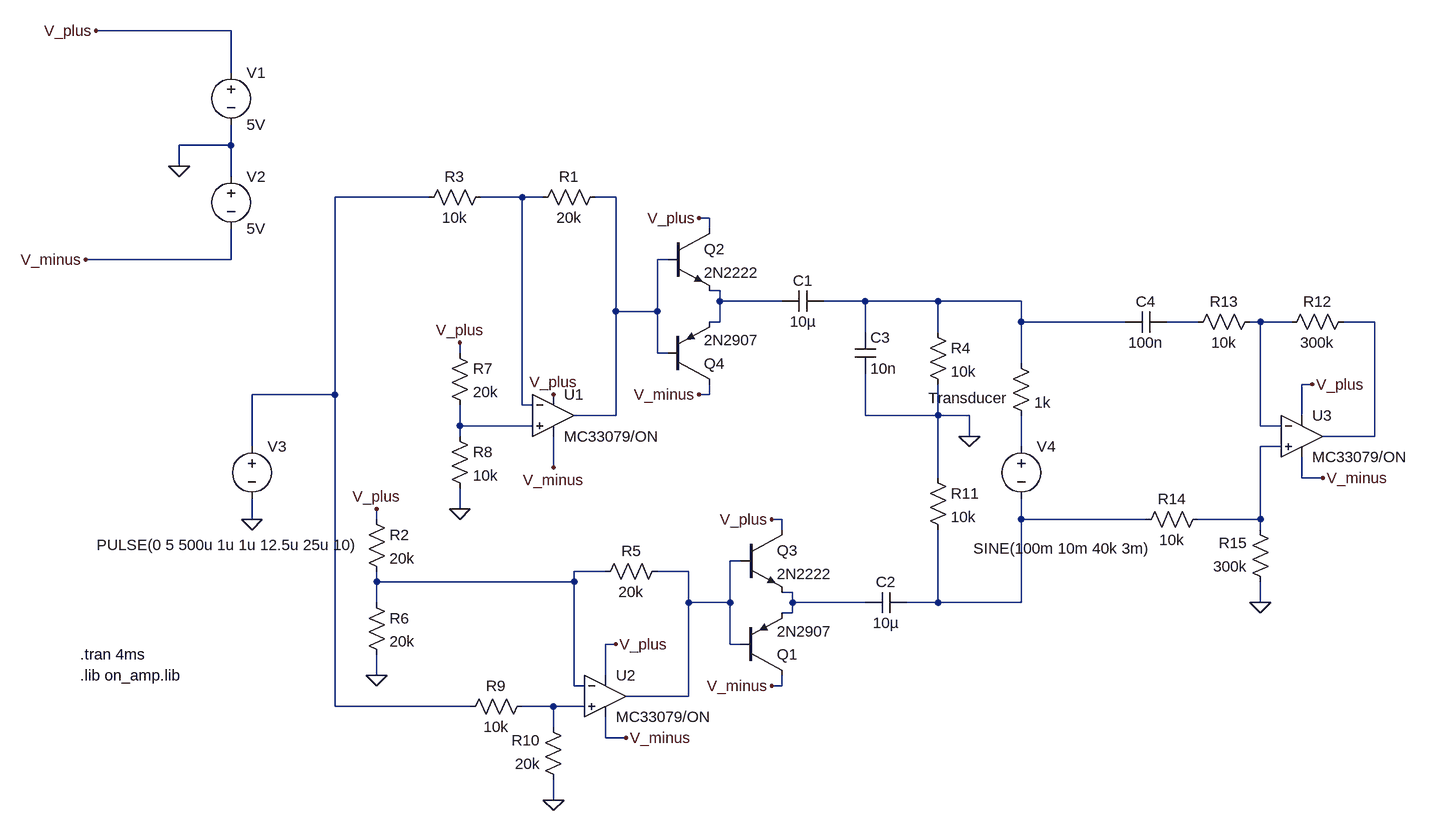
[diagram p0: schematic opamp_send_nosaturation_v02.asc]
opamp_send_nosaturation_v02.asc, the LTspice schematic file:
Version 4
SHEET 1 920 840
WIRE -1024 -448 -1232 -448
WIRE -1024 -384 -1024 -448
WIRE -1024 -272 -1024 -304
WIRE -1024 -272 -1104 -272
WIRE -1104 -240 -1104 -272
WIRE -1024 -224 -1024 -272
WIRE -720 -192 -864 -192
WIRE -576 -192 -640 -192
WIRE -544 -192 -576 -192
WIRE -432 -192 -464 -192
WIRE -288 -160 -304 -160
WIRE -288 -144 -288 -160
WIRE -1024 -96 -1024 -144
WIRE -1024 -96 -1248 -96
WIRE -352 -96 -368 -96
WIRE -272 -48 -288 -48
WIRE -272 -32 -272 -48
WIRE -176 -32 -272 -32
WIRE -48 -32 -112 -32
WIRE 64 -32 -48 -32
WIRE 192 -32 64 -32
WIRE -432 -16 -432 -192
WIRE -368 -16 -368 -96
WIRE -368 -16 -432 -16
WIRE -272 0 -272 -32
WIRE -272 0 -288 0
WIRE 192 0 192 -32
WIRE 352 0 192 0
WIRE 464 0 416 0
WIRE 560 0 544 0
WIRE 608 0 560 0
WIRE 736 0 688 0
WIRE -48 16 -48 -32
WIRE 64 16 64 -32
WIRE -672 48 -672 32
WIRE -368 48 -368 -16
WIRE -352 48 -368 48
WIRE 192 64 192 0
WIRE 640 96 624 96
WIRE -864 112 -864 -192
WIRE -864 112 -992 112
WIRE -288 112 -288 96
WIRE -288 112 -304 112
WIRE -576 128 -576 -192
WIRE -560 128 -576 128
WIRE -432 144 -432 -16
WIRE -432 144 -496 144
WIRE -48 144 -48 80
WIRE 64 144 64 96
WIRE 64 144 -48 144
WIRE 112 144 64 144
WIRE 624 144 624 96
WIRE -672 160 -672 128
WIRE -560 160 -672 160
WIRE 560 160 560 0
WIRE 592 160 560 160
WIRE -672 176 -672 160
WIRE 112 176 112 144
WIRE 736 176 736 0
WIRE 736 176 656 176
WIRE -992 192 -992 112
WIRE 192 192 192 144
WIRE 592 192 560 192
WIRE -528 224 -528 176
WIRE 64 240 64 144
WIRE 624 240 624 208
WIRE 656 240 624 240
WIRE -672 288 -672 256
WIRE -992 304 -992 272
WIRE -800 304 -800 288
WIRE -176 304 -192 304
WIRE 192 304 192 272
WIRE 384 304 192 304
WIRE 560 304 560 192
WIRE 560 304 464 304
WIRE -176 320 -176 304
WIRE 560 320 560 304
WIRE -240 368 -256 368
WIRE -448 384 -496 384
WIRE -320 384 -368 384
WIRE -800 400 -800 384
WIRE -496 400 -496 384
WIRE -496 400 -800 400
WIRE -160 416 -176 416
WIRE -800 432 -800 400
WIRE -320 432 -320 384
WIRE -256 432 -256 368
WIRE -256 432 -320 432
WIRE -160 432 -160 416
WIRE -48 432 -160 432
WIRE 64 432 64 320
WIRE 64 432 16 432
WIRE 192 432 192 304
WIRE 192 432 64 432
WIRE 560 432 560 400
WIRE -160 448 -160 432
WIRE -160 448 -176 448
WIRE -432 496 -448 496
WIRE -256 496 -256 432
WIRE -240 496 -256 496
WIRE -800 544 -800 512
WIRE -448 544 -448 496
WIRE -496 560 -496 400
WIRE -480 560 -496 560
WIRE -176 560 -176 544
WIRE -176 560 -192 560
WIRE -320 576 -320 432
WIRE -320 576 -416 576
WIRE -864 592 -864 112
WIRE -656 592 -864 592
WIRE -528 592 -576 592
WIRE -480 592 -528 592
WIRE -528 624 -528 592
WIRE -448 640 -448 608
WIRE -416 640 -448 640
WIRE -528 736 -528 704
FLAG -1104 -240 0
FLAG -1232 -448 V_plus
FLAG -1248 -96 V_minus
FLAG -416 640 V_minus
FLAG -528 224 V_minus
FLAG -528 112 V_plus
FLAG -432 496 V_plus
FLAG -992 304 0
FLAG -800 288 V_plus
FLAG -800 544 0
FLAG -672 32 V_plus
FLAG -672 288 0
FLAG -528 736 0
FLAG -304 -160 V_plus
FLAG -304 112 V_minus
FLAG -192 560 V_minus
FLAG -192 304 V_plus
FLAG 112 176 0
FLAG 656 240 V_minus
FLAG 640 96 V_plus
FLAG 560 432 0
SYMBOL Opamps\\opamp2 -528 80 R0
SYMATTR InstName U1
SYMATTR Value MC33079/ON
SYMBOL Opamps\\opamp2 -448 512 R0
SYMATTR InstName U2
SYMATTR Value MC33079/ON
SYMBOL voltage -1024 -400 R0
WINDOW 123 0 0 Left 0
WINDOW 39 0 0 Left 0
SYMATTR InstName V1
SYMATTR Value 5V
SYMBOL voltage -1024 -240 R0
WINDOW 123 0 0 Left 0
WINDOW 39 0 0 Left 0
SYMATTR InstName V2
SYMATTR Value 5V
SYMBOL voltage -992 176 R0
WINDOW 123 0 0 Left 0
WINDOW 39 0 0 Left 0
WINDOW 3 -239 167 Left 0
SYMATTR Value PULSE(0 5 500u 1u 1u 12.5u 25u 10)
SYMATTR InstName V3
SYMBOL res 176 48 R0
WINDOW 0 -127 69 Left 0
SYMATTR InstName Transducer
SYMATTR Value 1k
SYMBOL res -448 -208 R90
WINDOW 0 0 56 VBottom 0
WINDOW 3 32 56 VTop 0
SYMATTR InstName R1
SYMATTR Value 20k
SYMBOL res -352 368 R90
WINDOW 0 0 56 VBottom 0
WINDOW 3 32 56 VTop 0
SYMATTR InstName R5
SYMATTR Value 20k
SYMBOL res -816 288 R0
SYMATTR InstName R2
SYMATTR Value 20k
SYMBOL res -816 416 R0
SYMATTR InstName R6
SYMATTR Value 20k
SYMBOL res -624 -208 R90
WINDOW 0 0 56 VBottom 0
WINDOW 3 32 56 VTop 0
SYMATTR InstName R3
SYMATTR Value 10k
SYMBOL res -688 32 R0
SYMATTR InstName R7
SYMATTR Value 20k
SYMBOL res -688 160 R0
SYMATTR InstName R8
SYMATTR Value 10k
SYMBOL res -560 576 R90
WINDOW 0 0 56 VBottom 0
WINDOW 3 32 56 VTop 0
SYMATTR InstName R9
SYMATTR Value 10k
SYMBOL res -512 720 R180
WINDOW 0 36 76 Left 0
WINDOW 3 36 40 Left 0
SYMATTR InstName R10
SYMATTR Value 20k
SYMBOL pnp -240 544 M180
SYMATTR InstName Q1
SYMATTR Value 2N2907
SYMBOL npn -352 -144 R0
SYMATTR InstName Q2
SYMATTR Value 2N2222
SYMBOL npn -240 320 R0
SYMATTR InstName Q3
SYMATTR Value 2N2222
SYMBOL pnp -352 96 M180
SYMATTR InstName Q4
SYMATTR Value 2N2907
SYMBOL voltage 192 176 R0
WINDOW 123 0 0 Left 0
WINDOW 39 0 0 Left 0
WINDOW 3 -74 173 Left 0
SYMATTR Value SINE(100m 10m 40k 3m)
SYMATTR InstName V4
SYMBOL res 48 0 R0
SYMATTR InstName R4
SYMATTR Value 10k
SYMBOL cap -112 -48 R90
WINDOW 0 0 32 VBottom 0
WINDOW 3 32 32 VTop 0
SYMATTR InstName C1
SYMATTR Value 10µ
SYMBOL cap 16 416 R90
WINDOW 0 0 32 VBottom 0
WINDOW 3 32 32 VTop 0
SYMATTR InstName C2
SYMATTR Value 10µ
SYMBOL res 48 224 R0
SYMATTR InstName R11
SYMATTR Value 10k
SYMBOL cap -64 16 R0
SYMATTR InstName C3
SYMATTR Value 10n
SYMBOL Opamps\\opamp2 624 112 R0
SYMATTR InstName U3
SYMATTR Value MC33079/ON
SYMBOL res 704 -16 R90
WINDOW 0 0 56 VBottom 0
WINDOW 3 32 56 VTop 0
SYMATTR InstName R12
SYMATTR Value 300k
SYMBOL res 560 -16 R90
WINDOW 0 0 56 VBottom 0
WINDOW 3 32 56 VTop 0
SYMATTR InstName R13
SYMATTR Value 10k
SYMBOL res 480 288 R90
WINDOW 0 0 56 VBottom 0
WINDOW 3 32 56 VTop 0
SYMATTR InstName R14
SYMATTR Value 10k
SYMBOL res 576 416 R180
WINDOW 0 36 76 Left 0
WINDOW 3 36 40 Left 0
SYMATTR InstName R15
SYMATTR Value 300k
SYMBOL cap 416 -16 R90
WINDOW 0 0 32 VBottom 0
WINDOW 3 32 32 VTop 0
SYMATTR InstName C4
SYMATTR Value 100n
TEXT -1256 544 Left 0 !.lib on_amp.lib
TEXT -1256 512 Left 0 !.tran 4ms

The netlist it stands for:
* opamp_send_nosaturation_v02.asc
XU1 N009 N002 V_plus V_minus N003 MC33079/ON  ; pins In+ In- V+ V- OUT
XU2 N016 N014 V_plus V_minus N013 MC33079/ON  ; pins In+ In- V+ V- OUT
V1 V_plus 0 5V
V2 0 V_minus 5V
V3 N001 0 PULSE(0 5 500u 1u 1u 12.5u 25u 10)
R§Transducer N005 N010 1k
R1 N003 N002 20k
R5 N013 N014 20k
R2 V_plus N014 20k
R6 N014 0 20k
R3 N002 N001 10k
R7 V_plus N009 20k
R8 N009 0 10k
R9 N016 N001 10k
R10 0 N016 20k
Q1 V_minus N013 N015 0 2N2907
Q2 V_plus N003 N004 0 2N2222
Q3 V_plus N013 N015 0 2N2222
Q4 V_minus N003 N004 0 2N2907
V4 N010 N012 SINE(100m 10m 40k 3m)
R4 N005 0 10k
C1 N005 N004 10µ
C2 N012 N015 10µ
R11 0 N012 10k
C3 N005 0 10n
XU3 N011 N007 V_plus V_minus N008 MC33079/ON  ; pins In+ In- V+ V- OUT
R12 N008 N007 300k
R13 N007 N006 10k
R14 N011 N012 10k
R15 0 N011 300k
C4 N006 N005 100n
.model NPN NPN
.model PNP PNP
.lib standard.bjt
.lib on_amp.lib
.tran 4ms
.backanno
.end